# EAGLE design card-terminal (EAGLE 6.2)
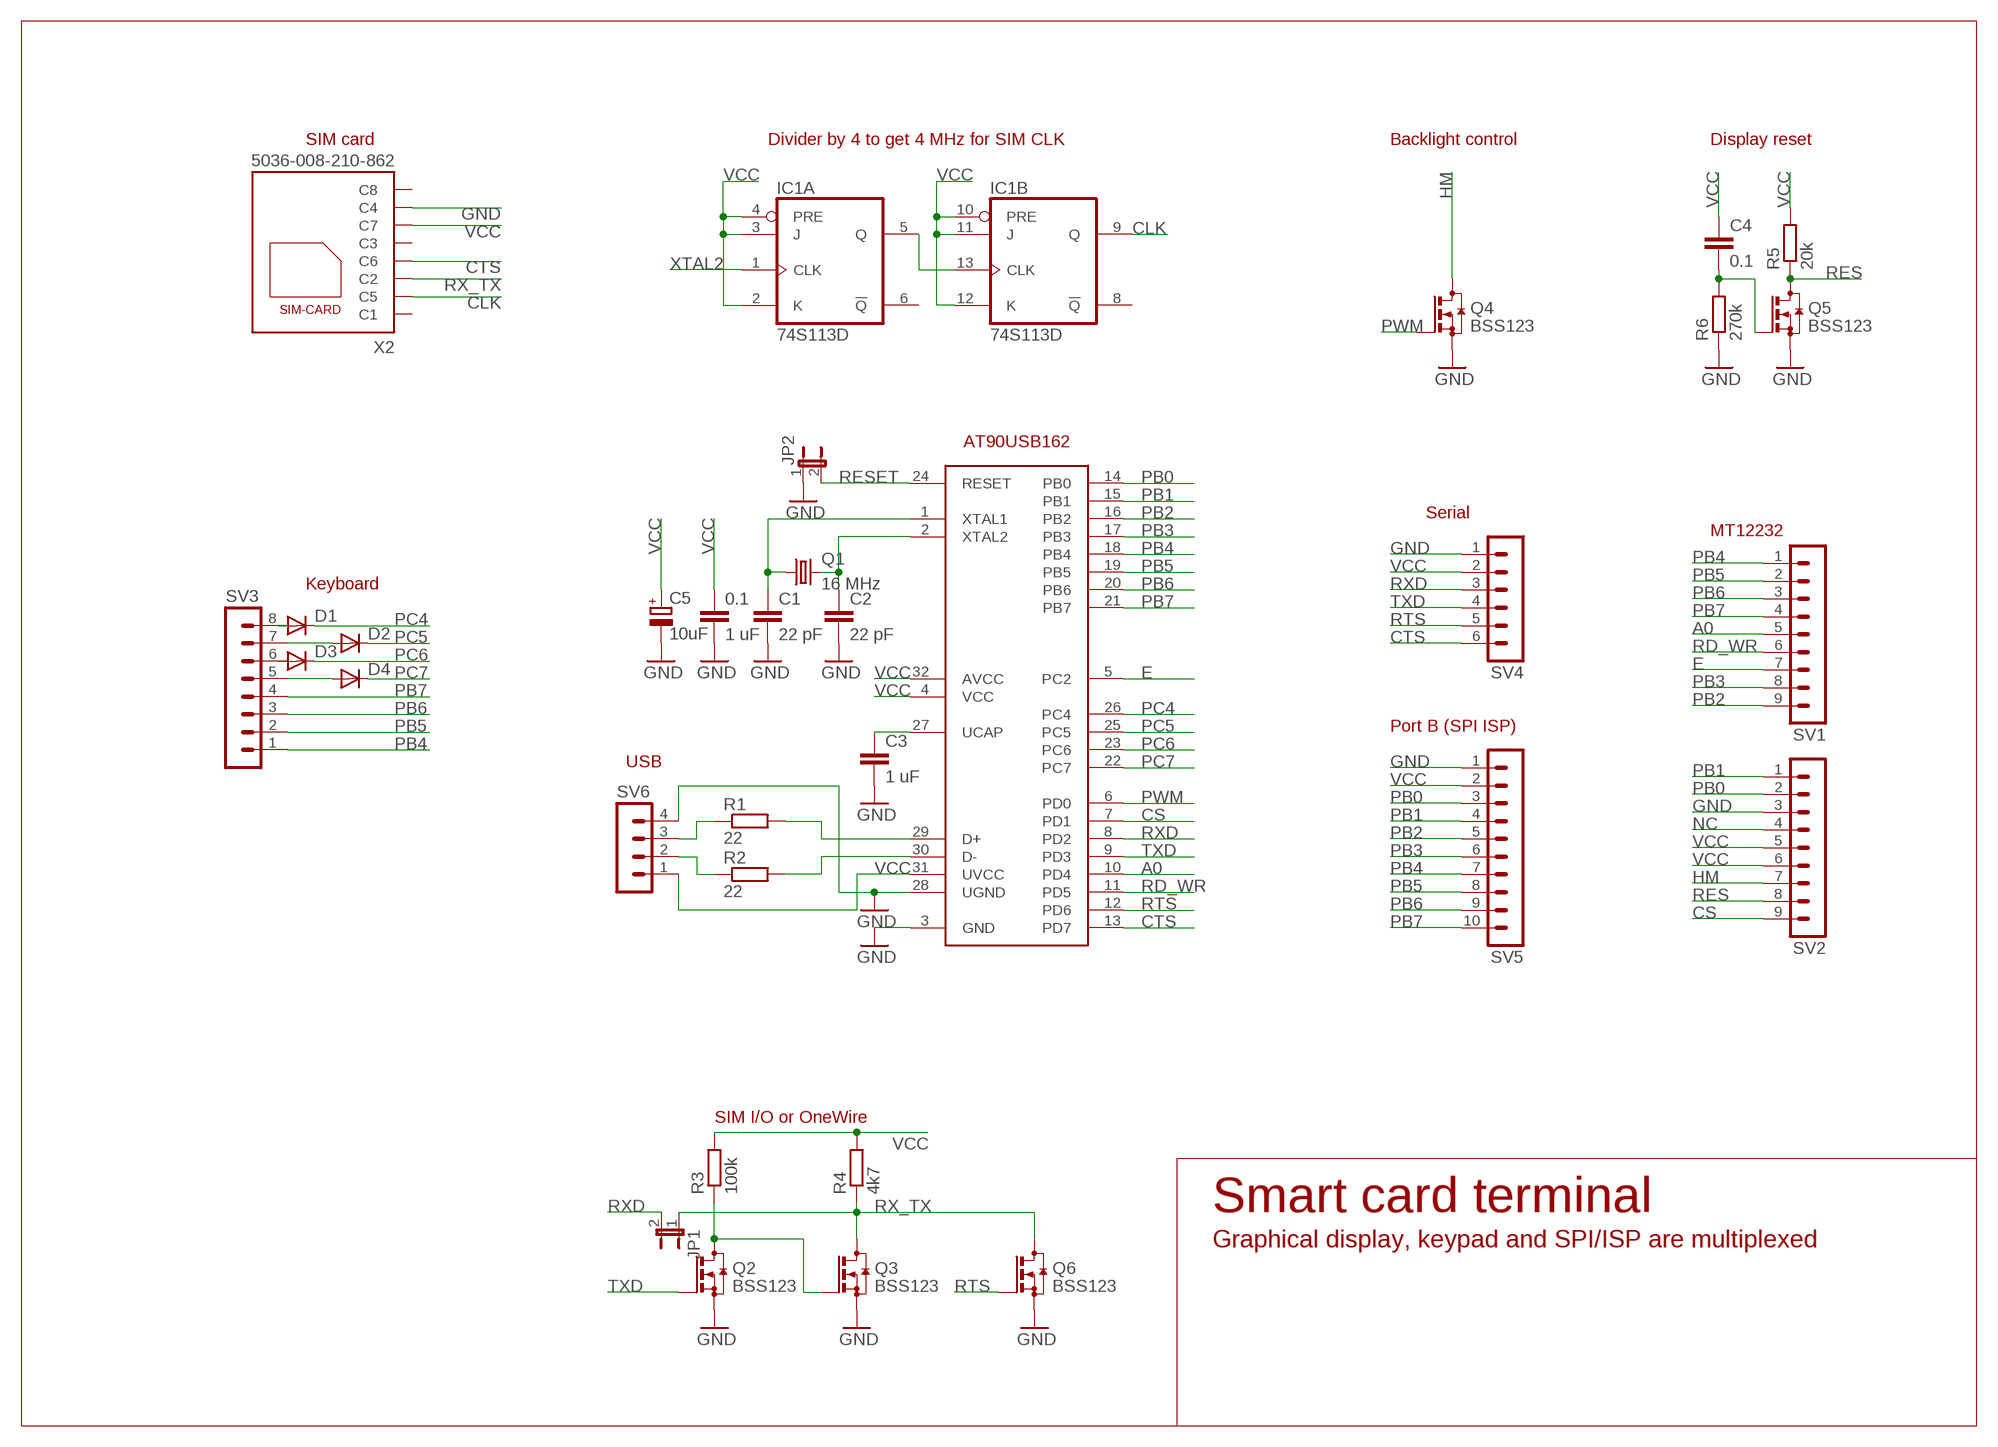
[diagram p0: schematic, sheet 1]

## Parts
0.1  1 uF  C-EUC0805  [C0805]
C1  22 pF  C-EUC0805  [C0805]
C2  22 pF  C-EUC0805  [C0805]
C3  1 uF  C-EUC0805  [C0805]
C4  0.1  C-EUC0805  [C0805]
C5  10uF  CPOL-EU153CLV-0505  [153CLV-0505]
D1  DIODE-MINIMELF  [MINIMELF]
D2  DIODE-MINIMELF  [MINIMELF]
D3  DIODE-MINIMELF  [MINIMELF]
D4  DIODE-MINIMELF  [MINIMELF]
IC1  74S113D  [SO14]
JP1  JP1E  [JP1]
JP2  JP1E  [JP1]
Q1  16 MHz  CRYSTALHC49S  [HC49/S]
Q2  BSS123  [SOT23]
Q3  BSS123  [SOT23]
Q4  BSS123  [SOT23]
Q5  BSS123  [SOT23]
Q6  BSS123  [SOT23]
R1  22  R-EU_M0805  [M0805]
R2  22  R-EU_M0805  [M0805]
R3  100k  R-EU_M0805  [M0805]
R4  4k7  R-EU_M0805  [M0805]
R5  20k  R-EU_M0805  [M0805]
R6  270k  R-EU_M0805  [M0805]
SV1  MA09-1W  [MA09-1W]
SV2  MA09-1W  [MA09-1W]
SV3  MA08-1  [MA08-1]
SV4  MA06-1  [MA06-1]
SV5  MA10-1W  [MA10-1W]
SV6  MA04-1  [MA04-1]
U$1  AT90USB162  [VQFP32]
X2  5036-008-210-862  [5036_008_210_862]

## Nets
A0: SV1.5 U$1.10(PD4)
CLK: IC1.9(B:Q) X2.C5
CS: SV2.9 U$1.7(PD1)
CTS: SV4.6 U$1.13(PD7) X2.C6
E: SV1.7 U$1.5(PC2)
F2: IC1.5(A:Q) IC1.13(B:CLK)
GND: 0.1.2 C1.2 C2.2 C3.2 C5.- JP2.1 Q2.2(S) Q3.2(S) Q4.2(S) Q5.2(S) Q6.2(S) R6.1 SV2.3 SV4.1 SV5.1 SV6.4 U$1.3(GND) U$1.28(UGND) X2.C4
HM: Q4.3(D) SV2.7
N$1: D1.A SV3.8
N$2: D2.A SV3.7
N$4: C4.2 Q5.1(G) R6.2
N$5: D3.A SV3.6
N$6: D4.A SV3.5
N$7: Q2.3(D) Q3.1(G) R3.1
N$9: C3.1 U$1.27(UCAP)
N$10: R2.2 U$1.30(D-)
N$11: R1.2 U$1.29(D+)
N$28: R1.1 SV6.3
N$29: R2.1 SV6.2
NC: SV2.4
PB0: SV2.2 SV5.3 U$1.14(PB0)
PB1: SV2.1 SV5.4 U$1.15(PB1)
PB2: SV1.9 SV5.5 U$1.16(PB2)
PB3: SV1.8 SV5.6 U$1.17(PB3)
PB4: SV1.1 SV3.1 SV5.7 U$1.18(PB4)
PB5: SV1.2 SV3.2 SV5.8 U$1.19(PB5)
PB6: SV1.3 SV3.3 SV5.9 U$1.20(PB6)
PB7: SV1.4 SV3.4 SV5.10 U$1.21(PB7)
PC4: D1.C U$1.26(PC4)
PC5: D2.C U$1.25(PC5)
PC6: D3.C U$1.23(PC6)
PC7: D4.C U$1.22(PC7)
PWM: Q4.1(G) U$1.6(PD0)
RD_WR: SV1.6 U$1.11(PD5)
RES: Q5.3(D) R5.1 SV2.8
RESET: JP2.2 U$1.24(RESET)
RTS: Q6.1(G) SV4.5 U$1.12(PD6)
RX_TX: JP1.1 Q3.3(D) Q6.3(D) R4.1 X2.C2
RXD: JP1.2 SV4.3 U$1.8(PD2)
TXD: Q2.1(G) SV4.4 U$1.9(PD3)
VCC: 0.1.1 C4.1 C5.+ IC1.2(A:K) IC1.3(A:J) IC1.4(A:PRE) IC1.10(B:PRE) IC1.11(B:J) IC1.12(B:K) R3.2 R4.2 R5.2 SV2.5 SV2.6 SV4.2 SV5.2 SV6.1 U$1.4(VCC) U$1.31(UVCC) U$1.32(AVCC) X2.C7
XTAL1: C1.1 Q1.1 U$1.1(XTAL1)
XTAL2: C2.1 IC1.1(A:CLK) Q1.2 U$1.2(XTAL2)
Unconnected: IC1.6(A:!Q) IC1.8(B:!Q) X2.C1 X2.C3 X2.C8

## Notes on the sheet
- SIM card | Divider by 4 to get 4 MHz for SIM CLK | Backlight control | Display reset
- AT90USB162
- Serial
- MT12232
- Keyboard
- Port B (SPI ISP)
- USB
- SIM I/O or OneWire
- Smart card terminal
- Graphical display, keypad and SPI/ISP are multiplexed

## Power pins joined to a net without a drawn wire
GND: IC1.7(P:GND)
VCC: IC1.14(P:VCC)

## Library data of the parts
0.1 C1-C4 = rcl:C-EU: CAPACITOR, European symbol
C5 = rcl:CPOL-EU: POLARIZED CAPACITOR, European symbol
D1-D4 = diode:DIODE-: DIODE
IC1 = 74xx-eu:74*113: Dual J-K negative edge triggered FLIP FLOP, preset
JP1 JP2 = jumper:JP1E: JUMPER
Q1 = crystal:CRYSTAL: CRYSTAL; OC_FARNELL: 1667008; OC_NEWARK: unknown
Q2-Q6 = transistor-small-signal:BSS123: N-CHANNEL MOS FET
R1-R6 = rcl:R-EU_: RESISTOR, European symbol
SV1 SV2 = con-lstb:MA09-1W: PIN HEADER; OC_FARNELL: unknown; OC_NEWARK: unknown
SV3 = con-lstb:MA08-1: PIN HEADER; OC_FARNELL: unknown; OC_NEWARK: unknown
SV4 = con-lstb:MA06-1: PIN HEADER; OC_FARNELL: unknown; OC_NEWARK: unknown
SV5 = con-lstb:MA10-1W: PIN HEADER; OC_FARNELL: unknown; OC_NEWARK: unknown
SV6 = con-lstb:MA04-1: PIN HEADER; OC_FARNELL: unknown; OC_NEWARK: unknown
U$1 = at90usb:AT90USB162
X2 = con-kyocera-elco:5036-008-210-862: SIM Card Module Source: http://www.kyocera-elco.com/prdct/pdf/5036.pdf; OC_FARNELL: unknown; OC_NEWARK: unknown

## Board
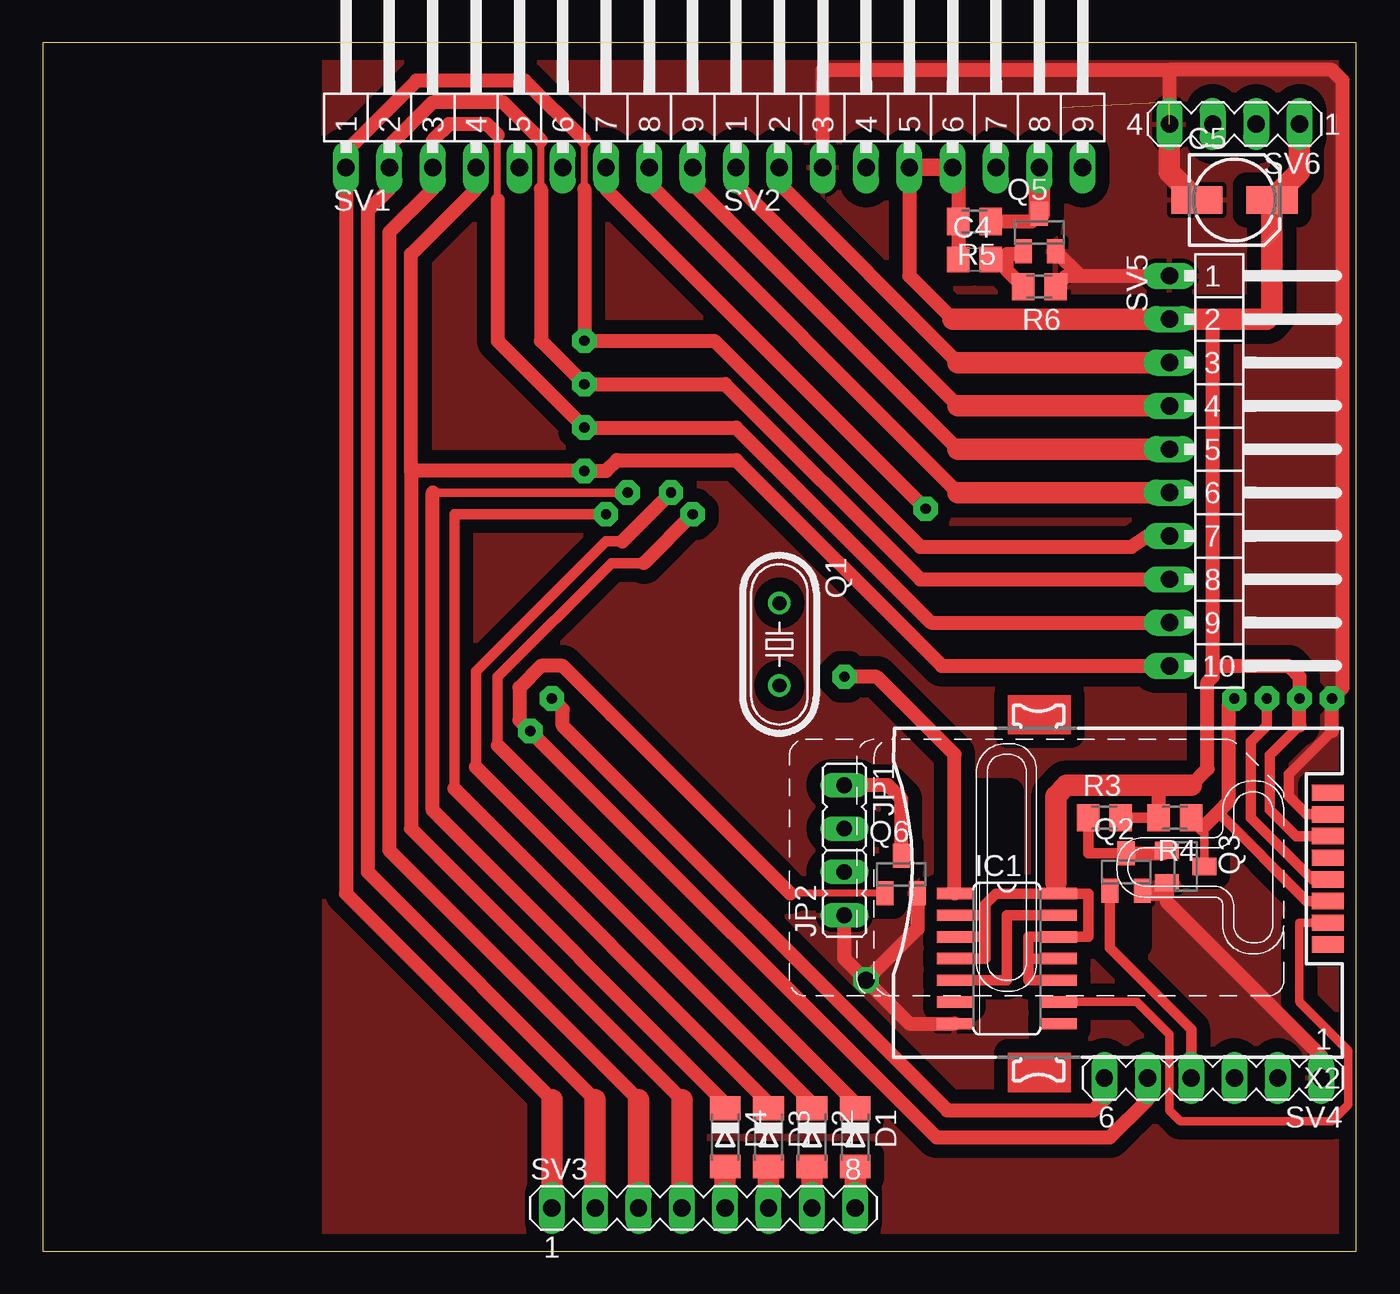
[diagram p1: board, top side]
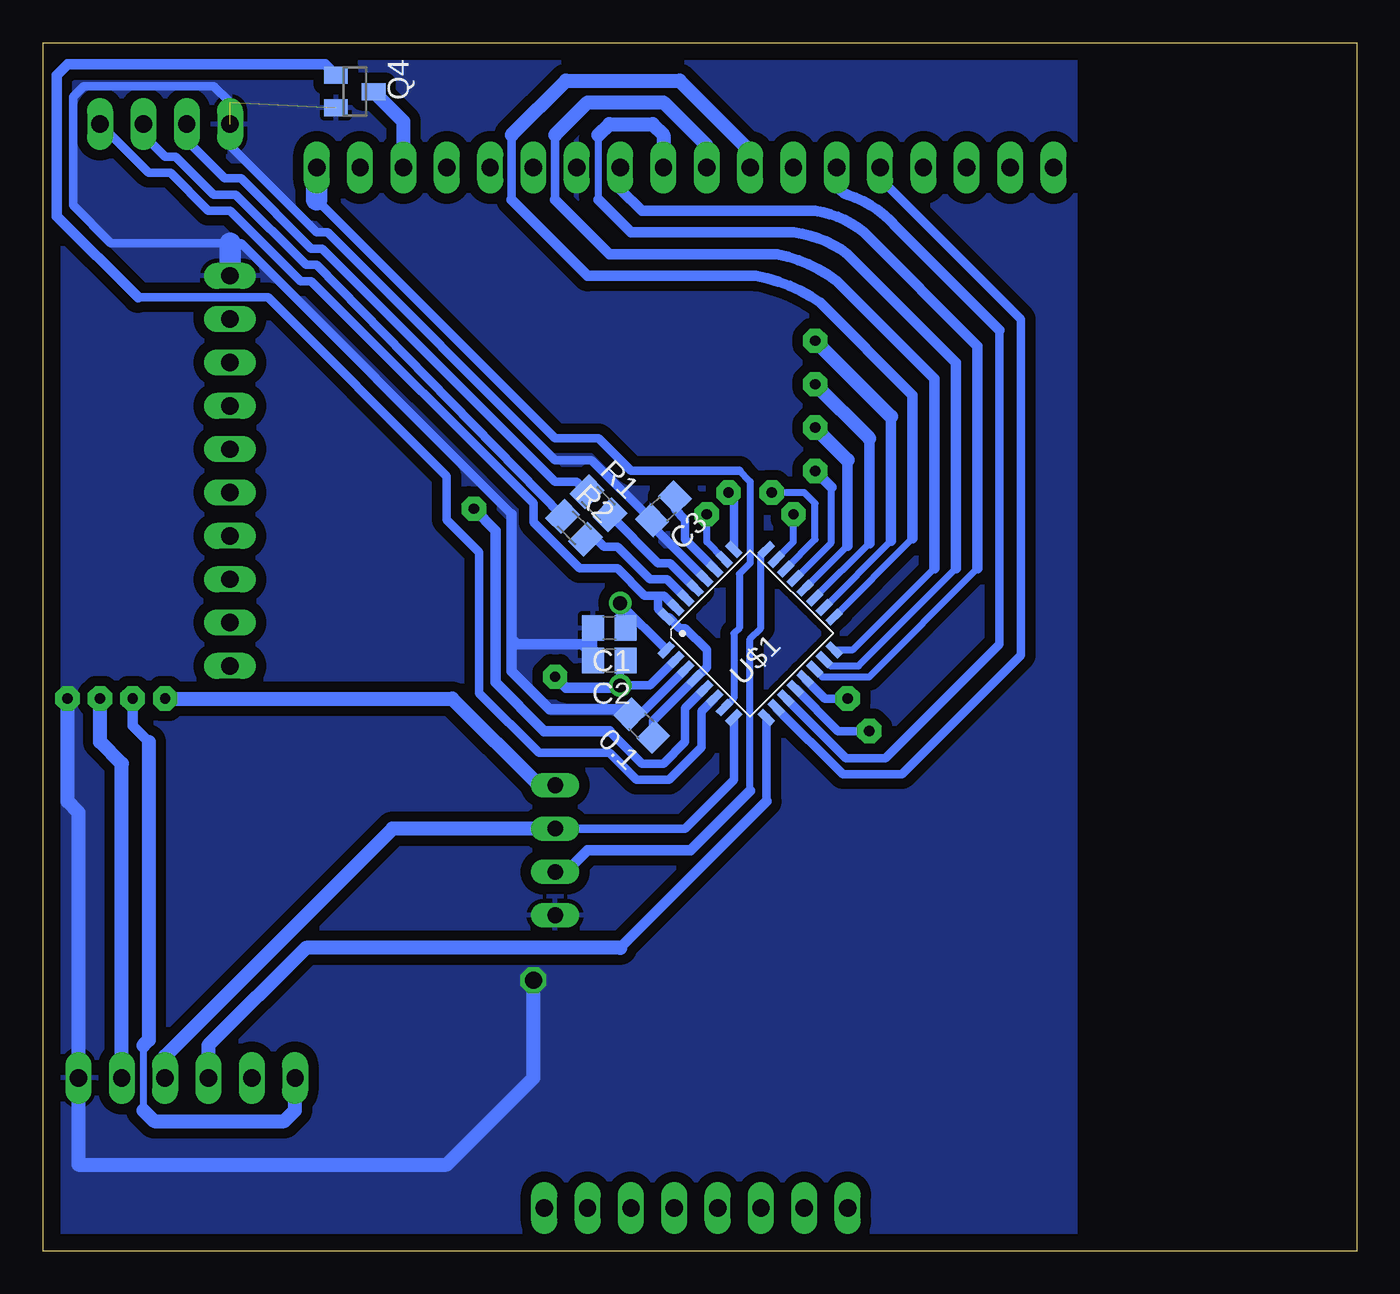
[diagram p2: board, bottom side, seen from below]

Size 77 x 70.81 mm. Coordinates in mm from the lower left corner, seen from the top.
Outline: 0,0 77,0 77,70.81 0,70.81 0,0
Copper layers (1*16): Top 0.035mm / dielectric 1.5mm / Bottom 0.035mm
Design rules: minimum track width 10mil, minimum drill 24mil, track to track 8mil, track to pad 8mil, pad to pad 8mil, via to via 8mil, smd to smd 8mil, copper to edge 40mil, drill to drill 8mil, minimum pad ring 10mil, minimum via ring 8mil, stop-mask expansion 4mil, vias tented up to drill 0mil, thermal gap 10mil

### Footprints (pad centres in the part's own frame; a part is rotated, then mirrored left to right if it is on the bottom)
C0805 = smd 1.3 x 1.5: 1 -0.95,0; 2 0.95,0
153CLV-0505 = smd 3 x 1.6: + 2.2,0; - -2.2,0
MINIMELF = smd 1.4 x 1.8: A 1.7,0; C -1.7,0
SO14 = smd 0.66 x 2.032: 1 -3.81,-3.073; 2 -2.54,-3.073; 3 -1.27,-3.073; 4 0,-3.073; 5 1.27,-3.073; 6 2.54,-3.073; 7 3.81,-3.073; 8 3.81,3.073; 9 2.54,3.073; 10 1.27,3.073; 11 0,3.073; 12 -1.27,3.073; 13 -2.54,3.073; 14 -3.81,3.073
JP1 = drill 0.914 long: 1 0,-1.27; 2 0,1.27
HC49/S = drill 0.813: 1 -2.413,0; 2 2.413,0
SOT23 = smd 1 x 1.4: 1 -0.95,-1.1; 2 0.95,-1.1; 3 0,1.1
M0805 = smd 1.3 x 1.6: 1 -0.95,0; 2 0.95,0
MA09-1W = drill 1.016 long: 1 -10.16,0; 2 -7.62,0; 3 -5.08,0; 4 -2.54,0; 5 0,0; 6 2.54,0; 7 5.08,0; 8 7.62,0; 9 10.16,0
MA08-1 = drill 1.016 long: 1 -8.89,0; 2 -6.35,0; 3 -3.81,0; 4 -1.27,0; 5 1.27,0; 6 3.81,0; 7 6.35,0; 8 8.89,0
MA06-1 = drill 1.016 long: 1 -6.35,0; 2 -3.81,0; 3 -1.27,0; 4 1.27,0; 5 3.81,0; 6 6.35,0
MA10-1W = drill 1.016 long: 1 -11.43,0; 2 -8.89,0; 3 -6.35,0; 4 -3.81,0; 5 -1.27,0; 6 1.27,0; 7 3.81,0; 8 6.35,0; 9 8.89,0; 10 11.43,0
MA04-1 = drill 1.016 long: 1 -3.81,0; 2 -1.27,0; 3 1.27,0; 4 3.81,0
VQFP32 = smd 1 x 0.45: 1 -4.15,2.8; 2 -4.15,2; 3 -4.15,1.2; 4 -4.15,0.4; 5 -4.15,-0.4; 6 -4.15,-1.2; 7 -4.15,-2; 8 -4.15,-2.8; 17 4.15,-2.8; 18 4.15,-2; 19 4.15,-1.2; 20 4.15,-0.4; 21 4.15,0.4; 22 4.15,1.2; 23 4.15,2; 24 4.15,2.8 | smd 0.45 x 1: 9 -2.8,-4.15; 10 -2,-4.15; 11 -1.2,-4.15; 12 -0.4,-4.15; 13 0.4,-4.15; 14 1.2,-4.15; 15 2,-4.15; 16 2.8,-4.15; 25 2.8,4.15; 26 2,4.15; 27 1.2,4.15; 28 0.4,4.15; 29 -0.4,4.15; 30 -1.2,4.15; 31 -2,4.15; 32 -2.8,4.15
5036_008_210_862 = smd 1.9 x 0.95: C1 -16.9,2.98; C2 -16.9,0.44; C3 -16.9,-2.1; C4 -16.9,-4.64; C5 -16.9,1.71; C6 -16.9,-0.83; C7 -16.9,-3.37; C8 -16.9,-5.91

### Placement (x,y rotation side)
0.1  41.91,30.8 135 bottom
C1  43.81,36.51 180 bottom
C2  43.81,34.61 180 bottom
C3  40.64,43.5 225 bottom
C4  54.61,58.1 0 top
C5  69.85,61.59 0 top
D1  47.62,6.67 270 top
D2  45.09,6.67 270 top
D3  42.55,6.67 270 top
D4  40.01,6.67 270 top
IC1  56.52,17.14 270 top
JP1  46.99,26.04 180 top
JP2  46.99,20.95 0 top
Q1  43.18,35.56 270 top
Q2  63.5,22.23 0 top
Q3  66.99,22.54 270 top
Q4  58.74,67.94 270 bottom
Q5  58.42,59.69 0 top
Q6  50.32,22.07 0 top
R1  44.45,43.81 315 bottom
R2  45.88,42.39 315 bottom
R3  62.23,25.4 0 top
R4  66.36,25.4 180 top
R5  54.61,60.33 180 top
R6  58.42,56.52 180 top
SV1  27.94,63.5 0 top
SV2  50.8,63.5 0 top
SV3  38.73,2.54 0 top
SV4  68.58,10.16 180 top
SV5  66.04,45.72 270 top
SV6  69.85,66.04 180 top
U$1  35.56,36.2 45 bottom
X2  58.42,20.95 180 top

### Tracks (layer width: path | path; a pad name or v marks a point on that pad's centre or on a via)
A0
  Bottom 0.508: U$1.10 30.13,27.94 26.67,27.94 19.68,34.92 19.68,54.61 27.94,62.87 SV1.5
CLK
  Top 0.508: X2.C5 73.66,19.25 73.66,14.61 76.52,11.75 76.52,8.57 75.56,7.62 66.67,7.62 66.04,8.26 66.04,12.7 64.14,14.61 IC1.9
CS
  Bottom 0.406: 36.2,45.72 35.56,45.09 35.56,40.32 36.2,39.69 36.2,36.51 36.51,36.2 36.51,32.41 U$1.7
  Bottom 0.508: 36.2,45.72 42.55,45.72 44.45,47.62 46.99,47.62 60.96,61.59
  Bottom 1.27: 60.96,61.59 SV2.9
CTS  (via drill 0.6 pad 1.42)
  Top 0.61: X2.C6 74.42,21.79 70.8,25.4 70.8,29.84 71.75,30.8 v71.75,32.38
  Top 0.813: SV4.6 62.23,8.89 61.59,8.26 53.02,8.26 30.48,30.8 30.48,31.75 v29.84,32.38
  Bottom 0.406: 71.12,12.06 71.12,8.26
  Bottom 0.508: U$1.13 31.18,32.38 v29.84,32.38
  Bottom 0.61: v71.75,32.38 71.75,30.8 70.8,29.84
  Bottom 0.813: 70.8,29.84 70.8,12.38 71.12,12.06 | 71.12,8.26 70.48,7.62 62.87,7.62 62.23,8.26 SV4.6
E  (via drill 0.6 pad 1.42)
  Top 0.508: 33.02,62.23 SV1.7
  Top 0.813: v51.75,43.5 33.02,62.23
  Bottom 0.508: U$1.5 39.37,31.82 39.37,29.84 40.64,28.57 41.91,28.57 43.81,30.48
  Bottom 0.61: 43.81,30.48 47.62,30.48 50.48,33.34 50.48,42.23 v51.75,43.5
F2
  Top 0.61: IC1.5 56.52,15.88 56.52,19.68 IC1.13
GND  (via drill 0.6 pad 1.42, 1)  (2 unrouted)
  Top 0.61: X2.C4 74.1,25.59 73.03,26.67 73.03,27.94 75.56,30.48
  Top 0.813: 66.04,69.22 75.56,69.22 76.2,68.58 76.2,33.02 v75.56,32.38 75.56,30.48 | 66.04,69.22 SV6.4 | SV4.1 74.93,11.43 65.89,20.47 65.89,20.95 | v48.26,15.88 50.8,13.34 IC1.7 | v48.26,15.88 46.99,17.14 JP2.1 | SV2.3 45.72,69.22 66.04,69.22 | Q5.2 60.81,57.15 | 60.81,57.15 SV5.1 | R6.1 60.01,57.15 60.81,57.15 | 65.89,20.95 Q3.2 | Q2.2 64.62,20.95 65.89,20.95 | Q6.2 51.27,18.89 v48.26,15.88
  Top 1.27: SV6.4 66.04,63.2 C5.-
  Bottom 0.508: U$1.28 40.99,42.2 C3.2 44.84,46.35 46.99,46.35 60.33,59.69 60.96,59.69 66.04,64.77 SV6.4 | U$1.3 41.98,31.47 0.1.2 | C2.2 C1.2 | 49.53,43.18 65.41,59.05 66.04,59.05 73.03,59.05 75.25,61.28 75.25,67.63 74.61,68.26 66.99,68.26 66.04,67.31
  Bottom 0.61: 45.09,35.56 44.77,35.24 C2.2 44.77,34.92 45.4,35.56 49.21,35.56 49.53,35.88 | 49.53,43.18 49.53,35.88 | 49.53,35.88 49.53,33.97 47.31,31.75 42.86,31.75 0.1.2
  Bottom 0.813: v48.26,15.88 48.26,10.16 53.34,5.08 74.93,5.08 SV4.1 74.93,25.72 75.56,26.35 v75.56,32.38
  Bottom 1.27: SV5.1 66.04,59.05
  pour Top (isolate 0.813): 16.51,0 76.83,0 76.83,70.48 16.51,70.48
  pour Bottom (isolate 0.61): 16.51,70.48 76.83,70.48 76.83,0 16.51,0
HM
  Bottom 0.813: SV2.7 55.88,66.19 Q4.3
N$1
  Top 1.27: SV3.8 D1.A
N$2
  Top 1.27: SV3.7 D2.A
N$4
  Top 0.813: Q5.1 57.3,58.42 56.52,58.42 | R6.2 56.52,57.47 56.52,58.42 | C4.2 56.52,58.42
N$5
  Top 1.27: SV3.6 D3.A
N$6
  Top 1.27: SV3.5 D4.A
N$7
  Top 0.61: Q2.3 61.28,23.32 R3.1
  Top 0.813: Q2.3 65.72,23.32 Q3.1
N$9
  Bottom 0.508: U$1.27 39.37,41.7 39.37,42.86 39.97,43.46 C3.1
N$10
  Bottom 0.508: U$1.30 40.43,39.37 41.43,39.37 43.34,41.27 44.13,41.27 44.73,41.87 R2.2
N$11
  Bottom 0.508: U$1.29 40.25,40.32 40.96,40.32 R1.2 | R1.2
N$28
  Bottom 0.508: SV6.3 68.58,65.09 66.36,62.87 65.41,62.87 61.28,58.74 60.64,58.74 46.99,45.09 45.72,45.09 R1.1
N$29
  Bottom 0.508: R2.1 60.96,57.78 61.59,57.78 65.72,61.91 66.99,61.91 69.22,64.14 69.85,64.14 71.12,65.41 SV6.2
PB0
  Top 0.406: 43.18,62.55 SV2.2
  Top 0.813: 53.66,52.07 43.18,62.55
  Top 1.27: SV5.3 53.66,52.07
  Bottom 0.406: U$1.14 31.32,33.66 28.57,33.66 22.23,40.01
  Bottom 0.61: 22.23,40.01 22.23,53.02 28.89,59.69 arc-31 31.75,60.96 41.91,60.96 43.18,62.23 SV2.2
PB1
  Top 0.813: 53.66,49.53 40.64,62.55 SV2.1
  Top 1.27: SV5.4 53.66,49.53
  Bottom 0.406: U$1.15 30.83,34.29 29.21,34.29 23.5,40.01 | 44.45,61.59 44.45,65.41
  Bottom 0.61: 23.5,40.01 23.5,52.07 29.84,58.42 arc-31 33.02,59.69 42.55,59.69 44.45,61.59
  Bottom 0.813: 44.45,65.41 43.81,66.04 41.27,66.04 40.64,65.41 SV2.1
PB2
  Top 0.813: 53.66,46.99 38.1,62.55 SV1.9
  Top 1.27: SV5.5 53.66,46.99
  Bottom 0.406: U$1.16 29.53,35.24 24.77,40.01
  Bottom 0.508: 46.99,61.59 46.99,65.41
  Bottom 0.61: 24.77,40.01 24.77,51.12 30.48,56.83 arc-26 33.97,58.42 43.81,58.42 46.99,61.59
  Bottom 0.813: 46.99,65.41 45.09,67.31 40.64,67.31 38.1,64.77 SV1.9
PB3
  Top 0.406: 35.56,62.55 SV1.8
  Top 0.813: 53.66,44.45 35.56,62.55
  Top 1.27: SV5.6 53.66,44.45
  Bottom 0.406: U$1.17 26.04,41.76
  Bottom 0.508: 49.53,61.59 49.53,65.41
  Bottom 0.61: 26.04,41.76 26.04,50.16 31.43,55.56 arc-26 35.24,57.15 45.09,57.15 49.53,61.59
  Bottom 0.813: 49.53,65.41 46.35,68.58 39.69,68.58 35.56,64.45 SV1.8
PB4  (via drill 0.6 pad 1.42)
  Top 0.406: 31.75,62.23 31.75,65.09
  Top 0.813: 31.75,62.23 v31.75,53.34 39.37,53.34 51.44,41.27 63.82,41.27 64.77,41.91 SV5.7 | 29.84,8.89 17.78,20.95 SV1.1 17.78,64.45 21.91,68.58 28.26,68.58 31.75,65.09
  Top 1.27: 29.84,8.89 SV3.1
  Bottom 0.406: U$1.18 27.3,41.62
  Bottom 0.61: 27.3,41.62 27.3,48.9
  Bottom 0.813: 27.3,48.9 v31.75,53.34
PB5  (via drill 0.6 pad 1.42)
  Top 0.406: 29.21,62.23 29.21,65.09
  Top 0.61: 20.32,62.23 SV1.2
  Top 0.813: SV5.8 51.44,39.37 40.01,50.8 v31.75,50.8 29.21,53.34 29.21,62.23 | 20.32,62.23 19.05,60.96 19.05,22.23 32.38,8.89 | 29.21,65.09 26.99,67.31 22.86,67.31 20.32,64.77 SV1.2
  Top 1.27: 32.38,8.89 SV3.2
  Bottom 0.406: U$1.19 28.57,41.48
  Bottom 0.61: 28.57,41.48 28.57,47.62
  Bottom 0.813: 28.57,47.62 v31.75,50.8
PB6  (via drill 0.6 pad 1.42)
  Top 0.406: 26.67,61.59 26.67,65.41
  Top 0.61: 22.86,62.23 SV1.3
  Top 0.813: SV5.9 52.07,36.83 40.64,48.26 v31.75,48.26 26.67,53.34 26.67,61.59 | 22.86,62.23 20.32,59.69 20.32,23.5 34.92,8.89 | 26.67,65.41 26.04,66.04 23.81,66.04 22.86,65.09 SV1.3
  Top 1.27: 34.92,8.89 SV3.3
  Bottom 0.406: U$1.20 29.84,41.34
  Bottom 0.61: 29.84,41.34 29.84,46.35
  Bottom 0.813: 29.84,46.35 v31.75,48.26
PB7  (via drill 0.6 pad 1.42)
  Top 0.813: SV5.10 52.7,34.29 40.64,46.35 33.66,46.35 33.02,45.72 v31.75,45.72 21.59,45.72 | 21.59,45.72 21.59,24.77 37.47,8.89 | 21.59,45.72 21.59,58.42 25.4,62.23 SV1.4
  Top 1.27: 37.47,8.89 SV3.4
  Bottom 0.406: U$1.21 30.8,41.52 30.8,44.77
  Bottom 0.61: 30.8,44.77 v31.75,45.72
PC4  (via drill 0.6 pad 1.42)
  Top 0.61: 35.24,40.32 33.34,40.32 26.67,33.66 26.67,29.64
  Top 0.813: v38.1,43.18 35.24,40.32 | 26.67,29.64 47.62,8.69 D1.C
  Bottom 0.406: U$1.26 38.1,41.56 v38.1,43.18
PC5  (via drill 0.6 pad 1.42)
  Top 0.61: 33.97,41.59 33.02,41.59 25.4,33.97 25.4,28.37
  Top 0.813: v36.83,44.45 33.97,41.59 | 25.4,28.37 45.09,8.69 D2.C
  Bottom 0.508: v36.83,44.45 36.52,44.13 U$1.25
PC6  (via drill 0.6 pad 1.42)
  Top 0.61: v33.02,43.18 24.13,43.18 24.13,27.1
  Top 0.813: 24.13,27.1 42.55,8.69 D3.C
  Bottom 0.406: U$1.23 33.02,41.56 v33.02,43.18
PC7  (via drill 0.6 pad 1.42)
  Top 0.508: v34.29,44.45 22.86,44.45
  Top 0.813: 22.86,44.45 22.86,25.83 40.01,8.69 D4.C
  Bottom 0.406: U$1.22 31.75,41.7 31.75,43.81 32.38,44.45 v34.29,44.45
PWM
  Bottom 0.508: U$1.6 38.42,31.64 38.42,29.53 40.32,27.62 42.23,27.62 43.81,29.21 47.94,29.21 51.44,32.7 51.44,40.96 53.34,42.86 53.34,45.4 63.82,55.88 71.44,55.88
  Bottom 0.61: 71.44,55.88 76.2,60.64 76.2,68.9 75.56,69.53 60.48,69.53 Q4.1
RD_WR
  Bottom 0.508: 20.95,53.98 20.95,35.56 27.62,28.89 29.95,28.89 U$1.11
  Bottom 0.61: 20.95,53.98 26.99,60.01 arc-31 29.84,61.91 arc61 30.48,62.55 arc29 SV1.6
RES
  Top 0.813: Q5.3 57.95,60.33 R5.1
  Top 1.27: Q5.3 SV2.8
RESET
  Bottom 0.406: 35.56,26.99 35.56,35.88 34.92,36.51 34.92,40.79 U$1.24
  Bottom 0.61: 35.56,26.99 39.05,23.5 45.09,23.5 46.35,22.23 JP2.2
RTS  (via drill 0.6 pad 1.42)
  Top 0.406: Q6.1 43.8,20.97
  Top 0.813: SV4.5 64.77,8.89 62.55,6.67 52.39,6.67 v28.57,30.48 27.94,31.11 27.94,33.02 29.21,34.29 30.48,34.29 33.34,31.43 43.8,20.97
  Bottom 0.508: U$1.12 30.41,30.48 v28.57,30.48
RX_TX  (via drill 0.6 pad 1.42)
  Top 0.508: R4.1 67.94,24.76 68.09,24.61 Q3.3 68.22,22.42
  Top 0.61: X2.C2 74.1,20.52 68.9,25.72
  Top 0.813: 67.94,24.76 68.9,25.72 69.53,26.35 69.53,32.07 v69.85,32.38 | Q6.3 50.32,26.51 49.53,27.3 JP1.1
  Bottom 0.813: v69.85,32.38 53.02,32.38 47.94,27.3 JP1.1
RXD
  Bottom 0.508: JP1.2 39.37,24.77 36.52,27.62 U$1.8
  Bottom 0.813: SV4.3 69.85,11.43 56.52,24.77 JP1.2
TXD
  Top 0.61: Q2.1 62.55,17.78 67.31,13.02 SV4.4
  Bottom 0.508: U$1.9 34.6,26.36
  Bottom 0.61: 34.6,26.36 43.18,17.78
  Bottom 0.813: 43.18,17.78 61.59,17.78 67.31,12.06 SV4.4
VCC  (via drill 0.6 pad 1.42)
  Top 0.406: 59.37,21.59 59.69,21.27 59.69,20.95
  Top 0.61: R3.2 R4.2 | 57.78,17.14 57.78,18.41 IC1.12 61.28,18.41 61.28,20.95 59.69,20.95 IC1.14 55.88,20.95 55.24,20.32 55.24,19.68 | 57.78,17.14 IC1.11 | IC1.10 57.78,15.88 57.78,17.14 | IC1.4 55.24,17.14 55.24,18.41 | 55.24,18.41 IC1.3 | IC1.2 55.24,19.68 | 55.24,19.68 55.24,18.41 | X2.C7 73.47,24.32 71.91,25.88 71.91,29.05 73.66,30.8
  Top 0.813: R4.2 65.41,27.3 | 68.58,34.29 68.58,54.61 | 68.58,34.29 73.03,34.29 73.66,33.66 v73.66,32.38 73.66,30.8 | 67.31,27.3 68.26,28.26 68.26,33.34 68.58,33.66 68.58,34.29 | SV2.5 50.8,57.15 53.34,54.61 | SV2.6 53.66,63.18 R5.2 C4.1
  Top 1.016: SV2.5 SV2.6
  Top 1.27: SV6.1 73.66,63.2 C5.+ 72.05,54.95 71.75,54.61 68.58,54.61 SV5.2 53.34,54.61 | 67.31,27.3 65.41,27.3 60.01,27.3 59.37,26.67 59.37,21.59
  Bottom 0.508: SV6.1 70.8,63.18 69.53,63.18 67.31,60.96 66.04,60.96 61.91,56.83 61.28,56.83 48.26,43.81 48.26,42.7 45.56,40.01 43.34,40.01 41.75,38.42 40.96,38.42 | 40.96,38.42 40.96,37.63 U$1.32 40.33,37.15 39.69,36.51 39.37,36.51 38.1,35.24 38.1,34.22 U$1.4 41.24,31.08 0.1.1 | U$1.31 40.61,38.42 40.96,38.42
  Bottom 0.813: SV4.2 72.39,28.57 73.66,29.84 v73.66,32.38
XTAL1
  Bottom 0.508: U$1.1 43.18,37.95 Q1.1 43.18,36.83 C1.1
XTAL2  (via drill 0.6 pad 1.42)
  Top 0.813: IC1.1 53.44,29.11 48.9,33.66 v46.99,33.66
  Bottom 0.508: C2.1 43.18,34.29 Q1.2 41.44,33.15 U$1.2
  Bottom 0.61: v46.99,33.66 46.35,33.02 43.31,33.02 Q1.2